# Altium schematic sheet CONN.SchDoc
size B
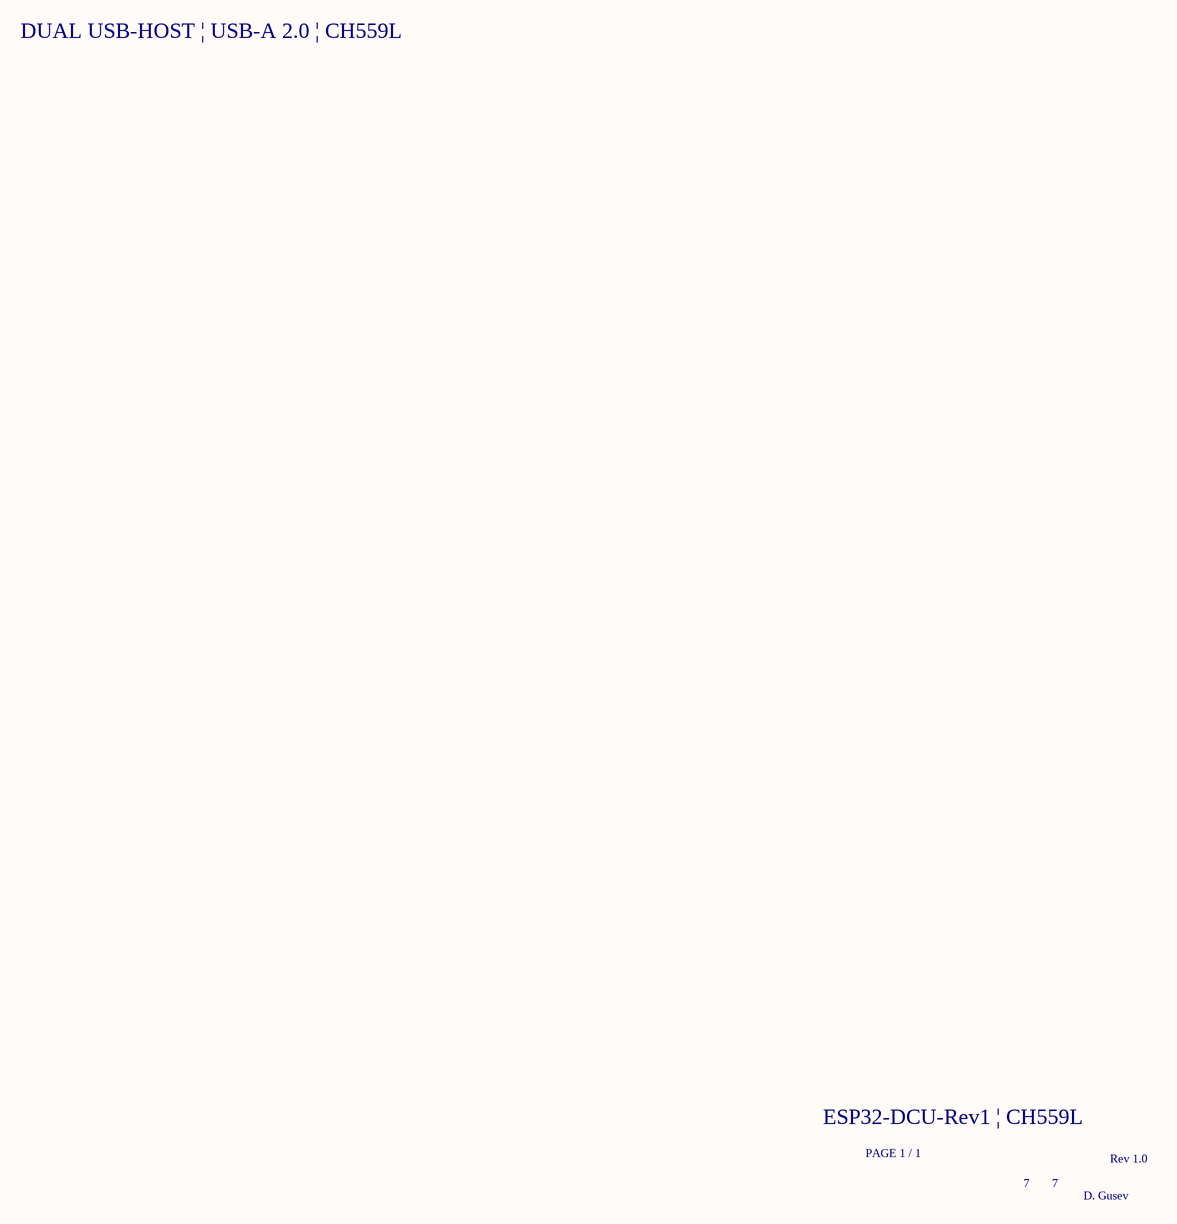
[diagram p0: CONN.SchDoc]

## Notes on the sheet
- DUAL USB-HOST | USB-A 2.0 | CH559L
- ESP32-DCU-Rev1 | CH559L
- PAGE 1 / 1
- 7
- Rev 1.0
- D. Gusev